# EAGLE design controlBoard (EAGLE 9.6.2)
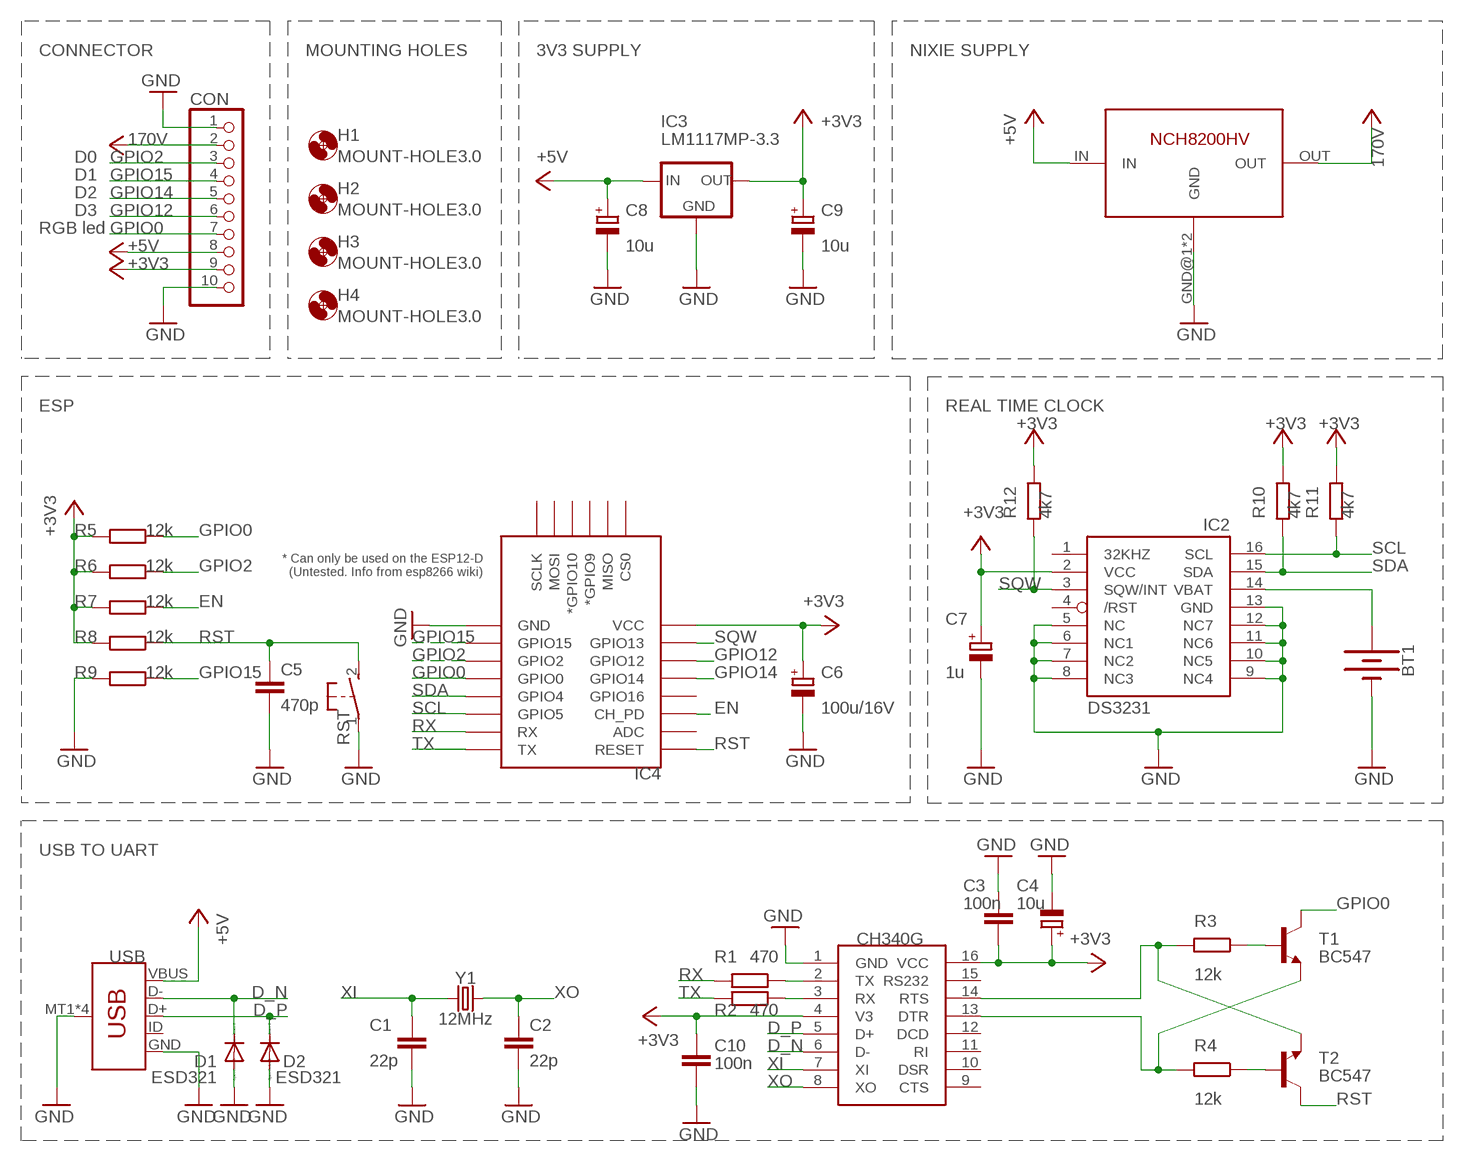
[diagram p0: schematic, sheet 1]

## Parts
1  NCH8200HV  [NCH8200HV]
BT1  BATTERY-20MM_PTH  [BATTCOM_20MM_PTH]
C1  22p  C-EUC0603  [C0603]
C2  22p  C-EUC0603  [C0603]
C3  100n  C-EUC0603  [C0603]
C4  10u  CPOL-EUSMCA  [SMC_A]
C5  470p  C-EUC0603  [C0603]
C6  100u/16V  CPOL-EUSMCD  [SMC_D]
C7  1u  CPOL-EUSMCA  [SMC_A]
C8  10u  CPOL-EUSMCA  [SMC_A]
C9  10u  CPOL-EUSMCA  [SMC_A]
C10  100n  C-EUC0603  [C0603]
CON  PINHD-1X10  [1X10]
D1  ESD321  DIODE-SOD523  [SOD523]
D2  ESD321  DIODE-SOD523  [SOD523]
H1  MOUNT-HOLE3.0  [3,0]
H2  MOUNT-HOLE3.0  [3,0]
H3  MOUNT-HOLE3.0  [3,0]
H4  MOUNT-HOLE3.0  [3,0]
IC2  DS3231/SO  [SO16W]
IC3  LM1117MP-3.3  [SOT223]
IC4  ESP12ESMD  [ESP12E-SMD]
R1  470  R-EU_R0603  [R0603]
R2  470  R-EU_R0603  [R0603]
R3  12k  R-EU_R0603  [R0603]
R4  12k  R-EU_R0603  [R0603]
R5  12k  R-EU_R0603  [R0603]
R6  12k  R-EU_R0603  [R0603]
R7  12k  R-EU_R0603  [R0603]
R8  12k  R-EU_R0603  [R0603]
R9  12k  R-EU_R0603  [R0603]
R10  4k7  R-EU_R0603  [R0603]
R11  4k7  R-EU_R0603  [R0603]
R12  4k7  R-EU_R0603  [R0603]
RST  31-XX  [B3F-31XX]
T1  BC547  BC808-NPN-SOT23-BEC  [SOT23-BEC]
T2  BC547  MMBT2222ALT1-NPN-SOT23-BEC  [SOT23-BEC]
U$2  CH340G  [SOIC16]
USB  USB_MICRO-B_SMT  [USB-MICROB]
Y1  12MHz  CRYSTAL-12MHZ"  [CRYSTAL-SMD-5X3.2-4PAD]

## Nets
+3V3: C3.2 C4.+ C6.+ C7.+ C9.+ C10.1 CON.9 IC2.2(VCC) IC3.2(OUT) IC3.4(OUT) IC4.VCC R5.2 R6.2 R7.2 R8.2 R10.1 R11.1 R12.1 U$2.4(V3) U$2.16(VCC)
+5V: 1.IN C8.+ CON.8 IC3.3(IN) USB.VBUS
D_N [diff_pairs]: D1.C U$2.6(D-) USB.D-
D_P [diff_pairs]: D2.C U$2.5(D+) USB.D+
EN: IC4.CH_PD R7.1
GND: 1.GND@1(GND) 1.GND@2(GND) BT1.2(-) C1.1 C2.1 C3.1 C4.- C5.2 C6.- C7.- C8.- C9.- C10.2 CON.1 CON.10 D1.A D2.A IC2.5(NC) IC2.6(NC1) IC2.7(NC2) IC2.8(NC3) IC2.9(NC4) IC2.10(NC5) IC2.11(NC6) IC2.12(NC7) IC2.13(GND) IC3.1(GND) IC4.GND R9.2 RST.1(P) U$2.1(GND) USB.GND USB.MT1(SHIELD) USB.MT2(SHIELD) USB.P$1(SHIELD) USB.P$2(SHIELD)
GPIO0: CON.7 IC4.GPIO0 R5.1 T1.C
GPIO2: CON.3 IC4.GPIO2 R6.1
GPIO12: CON.6 IC4.GPIO12
GPIO14: CON.5 IC4.GPIO14
GPIO15: CON.4 IC4.GPIO15 R9.1
N$8: R1.1 U$2.2(TX)
N$9: R2.1 U$2.3(RX)
N$11: R4.2 T1.E U$2.13(DTR)
N$12: R3.1 T1.B
N$13: R4.1 T2.B
N$14: BT1.1(+) IC2.14(VBAT)
N$15: R3.2 T2.E U$2.14(RTS)
RST: C5.1 IC4.RESET R8.1 RST.2(S) T2.C
RX: IC4.RXD0(RX) R1.2
SCL: IC2.16(SCL) IC4.GPIO5 R11.2
SDA: IC2.15(SDA) IC4.GPIO4 R10.2
SQW: IC2.3(SQW/INT) IC4.GPIO13 R12.2
TX: IC4.TXD0(TX) R2.2
VCC: 1.OUT CON.2 ; supply symbol labelled 170V
XI: C1.2 U$2.7(XI) Y1.1
XO: C2.2 U$2.8(XO) Y1.3
Unconnected: IC2.1(32KHZ) IC2.4(/RST) IC4.ADC IC4.CS0 IC4.GPIO9(*GPIO9) IC4.GPIO10(*GPIO10) IC4.GPIO16 IC4.MISO IC4.MOSI IC4.SCLK U$2.9(CTS) U$2.10(DSR) U$2.11(RI) U$2.12(DCD) U$2.15(RS232) USB.ID

## Notes on the sheet
- CONNECTOR | MOUNTING HOLES | 3V3 SUPPLY | NIXIE SUPPLY
- D0
- D1
- D2
- D3
- RGB led
- ESP | REAL TIME CLOCK
- USB TO UART

## Library data of the parts
1 = NCH8200HV:NCH8200HV
BT1 = SparkFun-Batteries:BATTERY: Battery - Single Cell A variety of battery chemistries, sizes, and footprints. Device List: 20MM_PTH - Coin Cell Battery Holder - 20mm (PTH) <https://www.sparkfun.com/products/783> 20MM_PTH_KIT- Coin Cell battery Holder - 20 mm (PTH) <http://www.sparkfun.com/products/783>kit version with special mask 6.8MM_PTH - Coin Cell Battery Holder - 6.8MM(SMD) <https://www.digikey.com/product-detail/en/seiko-instruments/MS621FE-FL11E/728-1057-ND/1889208?WT.srch=1&gclid=CNOQ5a6LzdQCFZS2wAodXCkE0g> 12MM_SMD - Coin Cell Battery Holder - 12mm (SMD) <https://www.sparkfun.com/products/10592> 12MM_PTH - Coin Cell Battery Holder - 12mm (PTH) <https://www.sparkfun.com/products/7948> 20MM_SMD - 20mm Coin Cell Battery Holder (SMD) (2 legs) Used on the Big Time Watch Kit <https://www.sparkfun.com/products/11734> 20MM_SMD_4LEGS - Coin Cell Battery Holder - 20mm (SMD) <https://www.sparkfun.com/products/11892> 20MM_SMD_4LEGS_OVERPASTE - Coin Cell Battery Holder - 20mm (SMD) <https://www.sparkfun.com/products/11892> (Over-paste on the legs) 24.5MM_PTH - Coin Cell Battery Holder - 24.5mm (PTH) <https://www.sparkfun.com/products/8863> 9V - 9V Battery Holder - PC Mount Used on the SparkFun SparkPunk Sound Kit <https://www.sparkfun.com/products/11177> and SparkFun SparkPunk Sequencer Kit <https://www.sparkfun.com/products/12707> 18650 - Battery Holder - 18650 (PTH) <https://www.sparkfun.com/products/13113> AA - Battery Holder - 1xAA (PTH) <https://www.sparkfun.com/products/7949> AAA - Battery Holder - 1xAAA (PTH) <https://www.sparkfun.com/products/12718> AA_KIT - Battery Holder - 1xAA (PTH) <https://www.sparkfun.com/products/7949> Special kit package - pads only have exposed copper on one side of the board. AAA_KIT - Battery Holder - 1xAAA (PTH) <https://www.sparkfun.com/products/12718> Special kit package - pads only have exposed copper on one side of the board.; PROD_ID: BATT-09031; SF_SKU: PRT-00783
C1-C3 C5 C10 = resistor:C-EU: CAPACITOR, European symbol
C4 C6-C9 = resistor:CPOL-EU: POLARIZED CAPACITOR, European symbol
CON = pinhead:PINHD-1X10: PIN HEADER
D1 D2 = diode:DIODE-: DIODE
H1-H4 = holes:MOUNT-HOLE: MOUNTING HOLE with drill center marker
IC2 = adafruit:DS3231
IC3 = lm1117:LM1117?-*: 800mA Low-Dropout Linear Regulator Source: http://ww1.microchip.com/downloads/en/DeviceDoc/39760d.pdf; MF: Texas Instruments; MPN: LM1117MP-3.3; OC_FARNELL: 9778195; OC_NEWARK: 28X3416
IC4 = esp8266modules:ESP12E: ESP12E Module
R1-R12 = resistor:R-EU_: RESISTOR, European symbol
RST = switch-omron:31-XX: OMRON SWITCH; MPN: B3F-3100; OC_FARNELL: 959704; OC_NEWARK: 36M3582
T1 T2 = transistor:*-NPN-: NPN Transistror BF959 corrected 2008.03.06
U$2 = ch340g:CH340G
USB = SparkFun-Connectors:USB_MICRO-B: USB Type Micro-B Connector Male/female and PTH/SMT variants SparkFun Products: SparkFun microB USB Breakout <https://www.sparkfun.com/products/12035> SparkFun USB microB Plug Breakout <https://www.sparkfun.com/products/10031> SparkFun ESP8266 Thing <https://www.sparkfun.com/products/13231>; PROD_ID: CONN-09505; SF_ID: PRT-08533
Y1 = SparkFun-Clocks:CRYSTAL-12MHZ: 12.0MHz Crystal Frequency: 12.0MHz Frequency Tolerance: ±20ppm Load Capacitance: 18pF SparkFun Products: SparkFun Logomatic <https://www.sparkfun.com/products/12772> Pocket AVR Programmer <https://www.sparkfun.com/products/9825>; PROD_ID: XTAL-08297

## Board
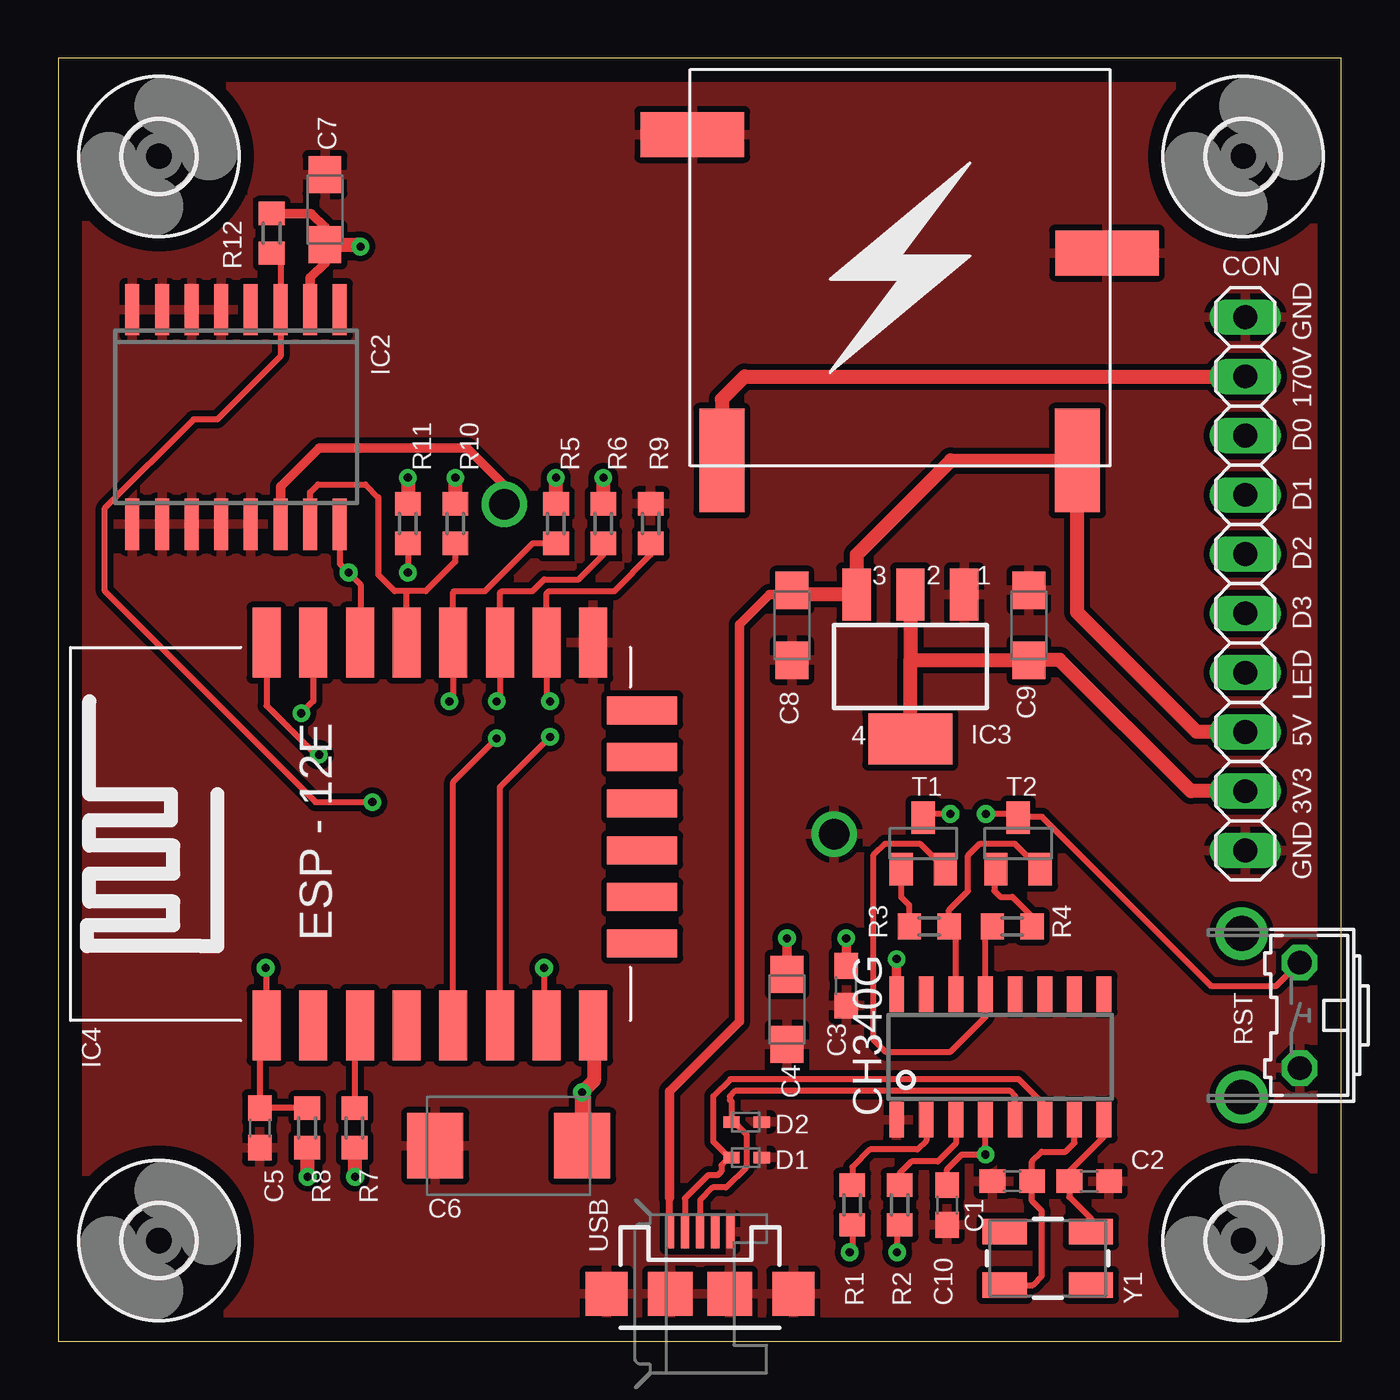
[diagram p1: board, top side]
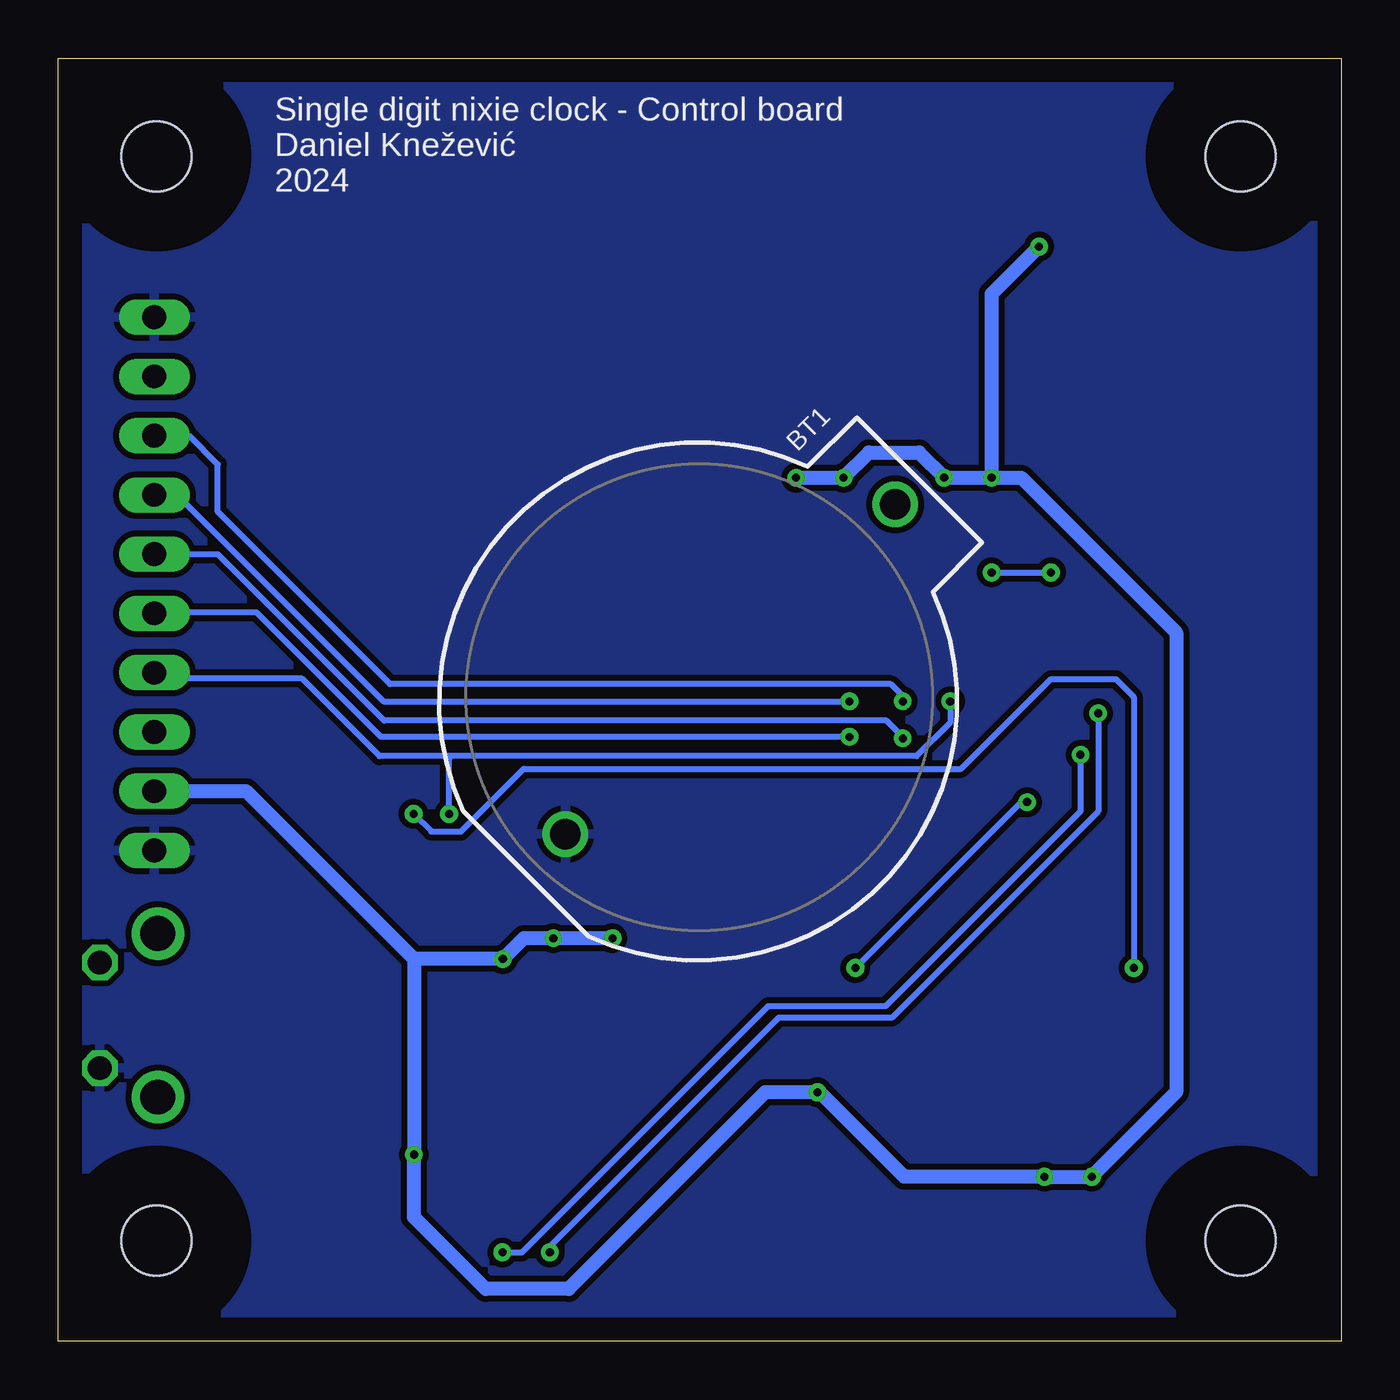
[diagram p2: board, bottom side, seen from below]

Size 55 x 55 mm. Coordinates in mm from the lower left corner, seen from the top.
Outline: 0,0 55,0 55,55 0,55 0,0
Copper layers (1*16): Top 0.035mm / dielectric 1.5mm / Bottom 0.035mm
Design rules "default *": minimum track width 6mil, minimum drill 0.35mm, track to track 10mil, track to pad 6mil, pad to pad 6mil, via to via 6mil, smd to smd 6mil, copper to edge 40mil, drill to drill 6mil, minimum pad ring 10mil, minimum via ring 8mil, stop-mask expansion 4mil, vias tented up to drill 0mil, thermal gap 10mil

### Footprints (pad centres in the part's own frame; a part is rotated, then mirrored left to right if it is on the bottom)
NCH8200HV = smd 4.445 x 1.93: GND@1 -8.763,-0.635; GND@2 9.017,-5.715 | smd 1.93 x 4.445: IN -7.493,8.255; OUT 7.747,8.255
BATTCOM_20MM_PTH = drill 1.3: 1 11.85,0; 2 -8.15,0
C0603 = smd 1.1 x 1: 1 -0.85,0; 2 0.85,0
SMC_A = smd 1.6 x 1.4: + -1.5,0; - 1.5,0
SMC_D = smd 2.4 x 2.8: + -3.15,0; - 3.15,0
1X10 = drill 1.016 long: 1 -11.43,0; 2 -8.89,0; 3 -6.35,0; 4 -3.81,0; 5 -1.27,0; 6 1.27,0; 7 3.81,0; 8 6.35,0; 9 8.89,0; 10 11.43,0
SOD523 = smd 0.7 x 0.5: A 0.7,0; C -0.6,0
3,0 = hole 3: 0,0
SO16W = smd 0.6 x 2.2: 1 -4.445,-4.6; 2 -3.175,-4.6; 3 -1.905,-4.6; 4 -0.635,-4.6; 5 0.635,-4.6; 6 1.905,-4.6; 7 3.175,-4.6; 8 4.445,-4.6; 9 4.445,4.6; 10 3.175,4.6; 11 1.905,4.6; 12 0.635,4.6; 13 -0.635,4.6; 14 -1.905,4.6; 15 -3.175,4.6; 16 -4.445,4.6
SOT223 = smd 1.219 x 2.235: 1 -2.311,-3.099; 2 0,-3.099; 3 2.311,-3.099 | smd 3.6 x 2.2: 4 0,3.099
ESP12E-SMD = smd 3 x 1.2: ADC -8.3,3.8; CH_PD -8.3,1.8; GND 8.1,-8.2; GPIO0 8.1,-2.2; GPIO2 8.1,-4.2; GPIO4 8.1,-0.2; GPIO5 8.1,1.8; GPIO12 -8.3,-4.2; GPIO13 -8.3,-6.2; GPIO14 -8.3,-2.2; GPIO15 8.1,-6.2; GPIO16 -8.3,-0.2; RESET -8.3,5.8; RXD0 8.1,3.8; TXD0 8.1,5.8; VCC -8.3,-8.2 | smd 1.2 x 3: CS0 -4.8,-10.3; GPIO9 -0.8,-10.3; GPIO10 1.2,-10.3; MISO -2.8,-10.3; MOSI 3.2,-10.3; SCLK 5.2,-10.3
R0603 = smd 1 x 1.1: 1 -0.85,0; 2 0.85,0
B3F-31XX = drill 1.016 octagon: 1 -2.261,-1.245; 2 2.261,-1.245 | drill 1.499 pad 2.159: 3 -3.505,1.245; 4 3.505,1.245
SOT23-BEC = smd 1 x 1.4: B -0.95,-1.1; C 0,1.1; E 0.95,-1.1
SOIC16 = smd 0.635 x 1.524: 1 -4.445,-2.695; 2 -3.175,-2.695; 3 -1.905,-2.695; 4 -0.635,-2.695; 5 0.635,-2.695; 6 1.905,-2.695; 7 3.175,-2.695; 8 4.445,-2.695; 9 4.445,2.695; 10 3.175,2.695; 11 1.905,2.695; 12 0.635,2.695; 13 -0.635,2.695; 14 -1.905,2.695; 15 -3.175,2.695; 16 -4.445,2.695
USB-MICROB = smd 1.4 x 0.35: D+ -2.65,0; D- -2.65,-0.65; GND -2.65,1.3; ID -2.65,0.65; VBUS -2.65,-1.3 | smd 1.9 x 1.8: MT1 0,-4; MT2 0,4 | smd 1.9 x 1.9: P$1 0,-1.27; P$2 0,1.27
CRYSTAL-SMD-5X3.2-4PAD = smd 1.9 x 1.1: 1 -1.85,-1.15; 2 1.85,-1.15; 3 1.85,1.15; 4 -1.85,1.15

### Placement (x,y rotation side)
1  36.2,46.01 180 top
BT1  27.5,27.5 45 bottom
C1  40.89,6.86 0 top
C2  44.2,6.86 180 top
C3  33.78,15.24 90 top
C4  31.24,14.22 270 top
C5  8.64,9.14 270 top
C6  19.3,8.38 180 top
C7  11.43,48.51 90 top
C8  31.45,30.7 270 top
C9  41.61,30.7 90 top
C10  38.1,5.84 270 top
CON  50.89,32.47 270 top
D1  29.46,7.87 0 top
D2  29.46,9.4 0 top
H1  50.8,50.8 0 top
H2  4.32,50.8 0 top
H3  4.32,4.32 0 top
H4  50.8,4.32 0 top
IC2  7.62,39.62 180 top
IC3  36.53,28.92 180 top
IC4  14.73,21.84 90 top
R1  34.04,5.84 270 top
R2  36.07,5.84 270 top
R3  37.34,17.78 0 top
R4  40.89,17.78 180 top
R5  21.34,35.05 90 top
R6  23.37,35.05 90 top
R7  12.7,9.14 270 top
R8  10.67,9.14 270 top
R9  25.4,35.05 90 top
R10  17.02,35.05 270 top
R11  14.99,35.05 270 top
R12  9.14,47.5 270 top
RST  51.98,13.97 90 top
T1  37.08,21.34 0 top
T2  41.15,21.34 0 top
U$2  40.39,12.19 0 top
USB  27.51,2.03 270 top
Y1  42.42,3.56 0 top

### Tracks (layer width: path | path; a pad name or v marks a point on that pad's centre or on a via)
+3V3  (via drill 0.35)
  Top 0.254: C10.1 38.1,7.37 38.73,8 v39.75,8 U$2.4
  Top 0.406: IC2.2 10.79,45.59 11.43,46.23 C7.+ 11.43,47.75 10.83,48.35 R12.1 | v31.24,17.27 C4.+ | C3.2 v33.78,17.27 | U$2.16 v35.94,16.38
  Top 0.61: R5.2 v21.34,37.02 | R6.2 v23.37,37.02 | R8.2 10.67,7.07 v10.69,7.05 | R7.2 12.7,7.07 v12.72,7.05 | v17.02,37.02 R10.1 | v14.99,37.02 R11.1 | IC3.4 36.53,29.17 | 36.53,29.17 41.59,29.17 C9.+ 41.63,29.21 42.93,29.21 48.55,23.58 CON.9 | IC3.2 36.53,29.17 | C6.+ v22.45,10.67 22.96,11.18 22.96,13.51 IC4.VCC | C7.+ 12.87,47.01 v12.95,46.93
  Bottom 0.61: v14.99,37.02 v17.02,37.02 18.1,38.1 20.26,38.1 v21.34,37.02 v23.37,37.02 | v14.99,37.02 13.72,37.02 7.07,30.38 7.07,10.68 10.69,7.06 v10.69,7.05 v12.72,7.05 18.73,7.05 22.35,10.67 v22.45,10.67 24.7,10.67 33.12,2.25 36.68,2.25 39.75,5.32 v39.75,8 39.75,16.38 | v12.95,46.93 14.99,44.89 v14.99,37.02 | v31.24,17.27 v33.78,17.27 35.05,17.27 v35.94,16.38 39.75,16.38 | 39.75,16.38 46.95,23.58 CON.9
+5V
  Top 0.305: USB.VBUS 26.21,6.15
  Top 0.406: 31.63,32.02 30.49,32.02 29.21,30.73 29.21,13.72 26.21,10.72 26.21,6.15
  Top 0.61: C8.+ 31.63,32.02 IC3.3 34.22,33.71 38.27,37.76 1.IN 43.69,31.24 48.81,26.12 CON.8
D_N
  Top 0.254: 28.76,7.87 28.08,8.56 28.08,10.5 28.81,11.23 41.18,11.23 42.29,10.12 U$2.6 | USB.D- 26.86,6.12 27.86,7.12 28.27,7.12 28.43,7.28 28.43,7.54 28.76,7.87 | D1.C 28.76,7.87
D_P
  Top 0.254: U$2.5 41.02,10.51 40.81,10.73 29.02,10.73 28.79,10.49 28.79,10.34 28.86,10.27 D2.C 28.96,9.4 29.49,8.87 29.49,7.46 28.62,6.59 28.05,6.59 27.51,6.05 USB.D+
EN
  Top 0.254: IC4.CH_PD 12.7,13.31 R7.1
GND
  Top 0.254: 25.55,35.9 25.65,36
  pour Bottom: 0,55.2 55.2,55.2 55.2,0 0,0
  pour Top (rank 2): 0,55.23 55.23,55.23 55.23,0 0,0
GPIO0  (via drill 0.35)
  Top 0.254: R5.1 20.34,34.2 18.29,32.15 16.98,32.15 16.93,32.11 IC4.GPIO0 16.93,27.6 v16.76,27.43 | v38.24,22.61 37.25,22.61 T1.C
  Bottom 0.254: v16.76,27.43 16.76,26.53 18.21,25.08 38.35,25.08 | CON.7 50.63,28.41 44.55,28.41 41.23,25.08 38.35,25.08 | v38.24,22.61 38.24,24.97 38.35,25.08
GPIO2  (via drill 0.35)
  Top 0.254: R6.1 23.37,33.72 22.31,32.66 20.83,32.66 20.32,32.15 19.01,32.15 18.93,32.08 IC4.GPIO2 18.93,27.57 v18.8,27.43
  Bottom 0.254: v18.8,27.43 18.8,27.66 19.3,28.17 40.78,28.17 48.17,35.56 48.17,37.59 49.4,38.82 CON.3
GPIO12  (via drill 0.35)
  Top 0.254: IC4.GPIO12 18.93,23.76 v21.08,25.91
  Bottom 0.254: v21.08,25.91 41.17,25.91 46.5,31.24 50.89,31.24 CON.6
GPIO14  (via drill 0.35)
  Top 0.254: v18.8,25.84 16.93,23.98 IC4.GPIO14
  Bottom 0.254: CON.5 48.16,33.74 41.03,26.61 19.49,26.61 18.8,25.91 v18.8,25.84
GPIO15  (via drill 0.35)
  Top 0.254: R9.1 25.4,33.72 23.84,32.15 21.04,32.15 20.93,32.04 IC4.GPIO15 20.93,27.58 v21.08,27.43
  Bottom 0.254: v21.08,27.43 41.06,27.43 49.91,36.28 CON.4
N$8
  Top 0.254: R1.1 34.04,7.45 34.8,8.22 36.83,8.22 37.21,8.6 U$2.2
N$9
  Top 0.254: U$2.3 38.48,8.48 37.71,7.71 36.58,7.71 36.07,7.2 R2.1
N$11
  Top 0.254: T1.E 36.93,21.34 35.45,21.34 34.95,20.84 34.95,12.91 35.46,12.41 38.25,12.41 39.75,13.9 U$2.13 39.75,17.49 R4.2
N$12
  Top 0.254: R3.1 36.49,18.69 36.13,19.04 T1.B
N$13
  Top 0.254: T2.B 40.13,20.17 40.13,19.3 40.39,19.05 40.89,19.05 41.74,18.2 R4.1
N$14
  Top 0.406: IC2.14 9.53,36.64 11.18,38.29 17.53,38.29 19.12,36.7 BT1.1
N$15
  Top 0.254: T2.E 41,21.34 39.51,21.34 39.01,20.83 39.01,19.3 38.19,18.49 R3.2 38.48,17.49 U$2.14
RST  (via drill 0.35)
  Top 0.254: R8.1 C5.1 8.64,13.25 IC4.RESET 8.93,15.96 v8.89,16 | v39.77,22.61 40.98,22.61 T2.C 41.2,22.48 42.17,22.48 49.44,15.21 52.2,15.21 RST.2
  Bottom 0.254: v39.77,22.61 39.01,21.84 37.74,21.84 35.05,24.53 16.3,24.53 12.45,28.38 9.65,28.38 8.89,27.62 v8.89,16
RX  (via drill 0.35)
  Top 0.254: IC4.RXD0 10.93,27.44 v10.41,26.92 | R1.2 34.04,3.92 v33.93,3.81
  Bottom 0.254: v10.41,26.92 10.41,22.72 19.26,13.87 24.12,13.87 33.93,4.06 v33.93,3.81
SCL  (via drill 0.35)
  Top 0.254: IC4.GPIO5 12.95,29.97 12.95,32.45 v12.45,32.96 12.06,33.34 IC2.16 | R11.2 v14.99,32.96
  Bottom 0.254: v14.99,32.96 v12.45,32.96
SDA
  Top 0.254: IC2.15 10.79,36.38 11.14,36.73 13.17,36.73 13.72,36.18 13.72,32.86 14.42,32.15 14.93,32.15 | IC4.GPIO4 14.93,32.15 | R10.2 17.02,33.42 15.75,32.15 14.93,32.15
SQW  (via drill 0.35)
  Top 0.254: v20.83,16 20.83,13.65 IC4.GPIO13 | v13.46,23.11 11.03,23.11 1.99,32.15 1.99,35.71 5.8,39.52 6.82,39.52 9.53,42.23 9.53,43.94 IC2.3 9.53,46.27 R12.2
  Bottom 0.254: v20.83,16 13.72,23.11 v13.46,23.11
TX  (via drill 0.35)
  Top 0.254: IC4.TXD0 8.93,27.25 11.03,25.15 v11.18,25.15 | R2.2 35.96,4.88 v35.96,3.81
  Bottom 0.254: v11.18,25.15 11.18,22.72 19.52,14.37 24.56,14.37 35.12,3.81 v35.96,3.81
VCC
  Top 0.61: 1.OUT 28.45,40.39 29.42,41.36 CON.2
XI
  Top 0.254: Y1.1 41.78,2.41 42.16,2.79 42.16,5.59 41.74,6.01 C1.2 41.74,7.71 42.16,8.13 43.18,8.13 43.56,8.51 U$2.7
XO
  Top 0.254: U$2.8 44.83,8.76 43.35,7.28 C2.2 43.35,6.18 44.27,5.26 Y1.3

### Text on the board
tNames: GND | 170V | D0 | D1 | D2 | D3 | LED | 5V | 3V3 | GND
bNames: Single digit nixie clock - Control board / Daniel Knežević / 2024